# EAGLE design 328 TQFP V3 (EAGLE 6.2)
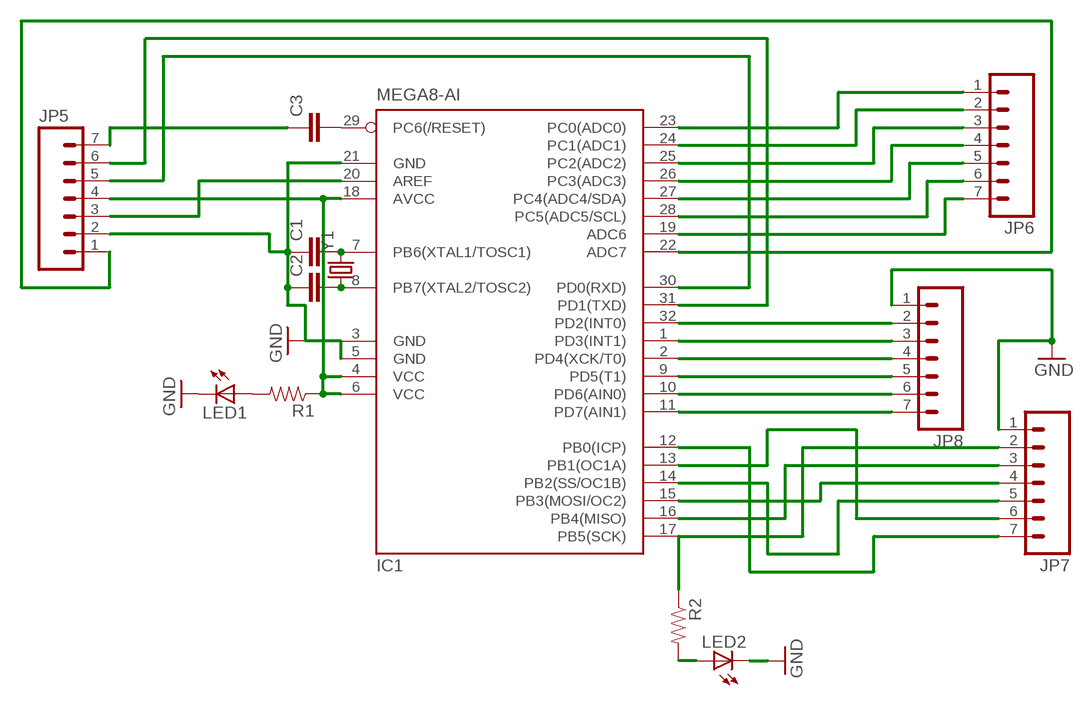
[diagram p0: schematic, sheet 1]

## Parts
C1  CAP0603-CAP  [0603-CAP]
C2  CAP0603-CAP  [0603-CAP]
C3  CAP0603-CAP  [0603-CAP]
IC1  MEGA8-AI  [TQFP32-08]
JP5  M07  [1X07]
JP6  M07  [1X07]
JP7  M07  [1X07]
JP8  M07  [1X07]
LED1  LED0603  [LED-0603]
LED2  LED0603  [LED-0603]
R1  RESISTOR0603-RES  [0603-RES]
R2  RESISTOR0603-RES  [0603-RES]
Y1  CRYSTAL5X3  [CRYSTAL-SMD-5X3]

## Nets
GND: C1.1 C2.1 IC1.3(GND) IC1.5(GND) IC1.21(GND) JP5.2 JP7.1 JP8.1 LED1.C LED2.C
N$1: LED1.A R1.2
N$2: IC1.4(VCC) IC1.6(VCC) IC1.18(AVCC) JP5.4 R1.1
N$3: C1.2 IC1.7(PB6(XTAL1/TOSC1)) Y1.3
N$4: C2.2 IC1.8(PB7(XTAL2/TOSC2)) Y1.1
N$5: C3.1 JP5.7
N$6: IC1.20(AREF) JP5.3
N$7: C3.2 IC1.29(PC6(/RESET))
N$8: IC1.31(PD1(TXD)) JP5.6
N$9: IC1.30(PD0(RXD)) JP5.5
N$10: IC1.23(PC0(ADC0)) JP6.1
N$11: IC1.24(PC1(ADC1)) JP6.2
N$12: IC1.25(PC2(ADC2)) JP6.3
N$13: IC1.26(PC3(ADC3)) JP6.4
N$14: IC1.27(PC4(ADC4/SDA)) JP6.5
N$15: IC1.28(PC5(ADC5/SCL)) JP6.6
N$16: IC1.19(ADC6) JP6.7
N$17: IC1.22(ADC7) JP5.1
N$18: IC1.17(PB5(SCK)) JP7.2 R2.1
N$19: IC1.16(PB4(MISO)) JP7.3
N$20: IC1.15(PB3(MOSI/OC2)) JP7.4
N$21: IC1.14(PB2(SS/OC1B)) JP7.5
N$22: IC1.13(PB1(OC1A)) JP7.6
N$23: IC1.12(PB0(ICP)) JP7.7
N$24: IC1.11(PD7(AIN1)) JP8.7
N$25: IC1.10(PD6(AIN0)) JP8.6
N$26: IC1.9(PD5(T1)) JP8.5
N$27: IC1.2(PD4(XCK/T0)) JP8.4
N$28: IC1.1(PD3(INT1)) JP8.3
N$29: IC1.32(PD2(INT0)) JP8.2
N$30: LED2.A R2.2

## Library data of the parts
C1-C3 = SparkFun:CAP: Capacitor Standard 0603 ceramic capacitor, and 0.1" leaded capacitor.
IC1 = atmel:MEGA8: MICROCONTROLLER 8 Kbytes FLASH, 1 kbytes SRAM, 512 bytes EEPROM, USART, 6-channel 10 bit ADC, 2-channel 8 bit ADC Pin compatible with Atmega48, ATMega88, ATMega168 Source: avr.lbr; MPN: ATMEGA8-16AU; OC_FARNELL: 9171371; OC_NEWARK: 73M8863
JP5-JP8 = SparkFun:M07: Header 7 Standard 7-pin 0.1" header. Use with straight break away headers (SKU : PRT-00116), right angle break away headers (PRT-00553), swiss pins (PRT-00743), machine pins (PRT-00117), and female headers (PRT-00115). NOTES ON THE VARIANTS LOCK and LOCK_LONGPADS... This footprint was designed to help hold the alignment of a through-hole component (i.e. 7-pin header) while soldering it into place. You may notice that each hole has been shifted either up or down by 0.005 of an inch from it's more standard position (which is usually a perfectly straight line). This slight alteration caused the pins (the squares in the middle) to touch the edges of the holes. Because they are alternating, it causes a "brace" to hold the header in place. 0.005 has proven to be the perfect amount of "off-center" position when using our standard breakaway headers. Although looks a little odd when you look at the bare footprint, once you have a header in there, the alteration is very hard to notice. Also, if you push a header all the way into place, it is covered up entirely on the bottom side. This idea of altering the position of holes to aid alignment will be further integrated into the Sparkfun Library for other footprints. It can help hold any component with 3 or more connection pins.
LED1 LED2 = SparkFun:LED: LEDs Standard schematic elements and footprints for 5mm, 3mm, 1206, and 0603 sized LEDs. 5mm - Spark Fun Electronics SKU : COM-00529 (and others)
R1 R2 = SparkFun:RESISTOR: Resistor Basic schematic elements and footprints for 0603, 1206, and PTH resistors.
Y1 = SparkFun:CRYSTAL: Crystals Various standard crystals. Proven footprints. Spark Fun Electronics SKU : COM-00534

## Board
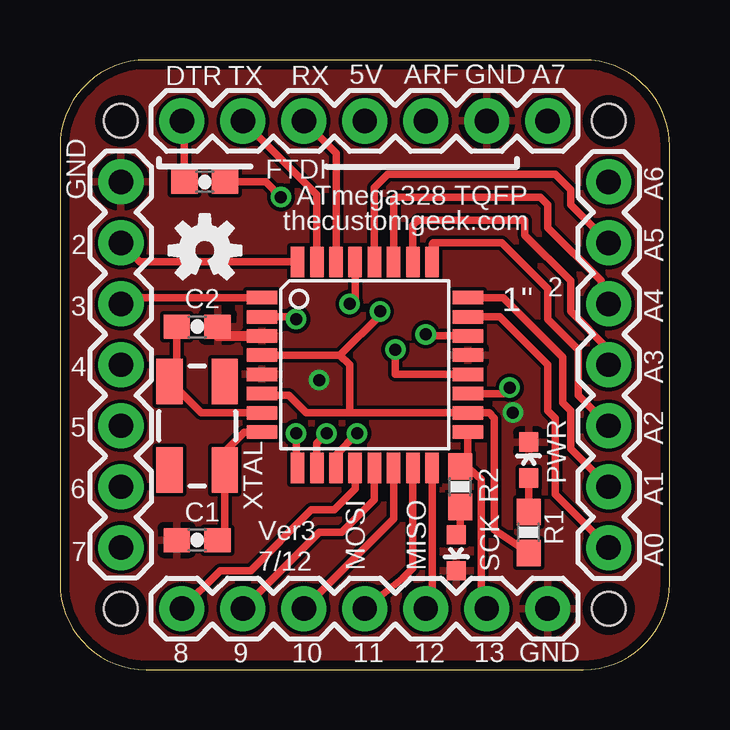
[diagram p1: board, top side]
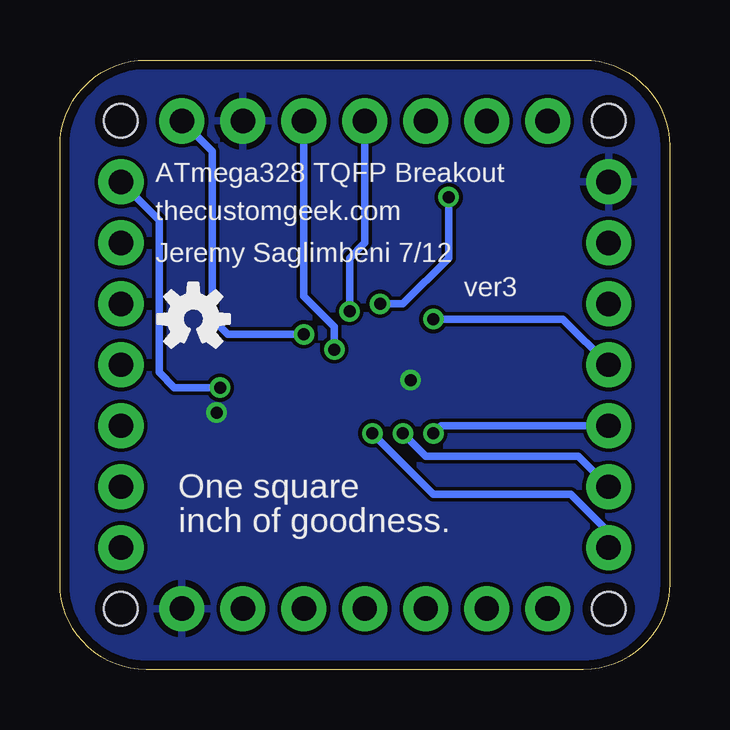
[diagram p2: board, bottom side, seen from below]

Size 25.4 x 25.4 mm. Coordinates in mm from the lower left corner, seen from the top.
Outline: 21.81,0 arc90 25.4,3.59 25.4,21.81 arc90 21.81,25.4 3.59,25.4 arc90 0,21.81 0,3.59 arc90 3.59,0 21.81,0
Copper layers (1*16): Top 0.0356mm / dielectric 1.5011mm / Bottom 0.0356mm
Design rules: minimum track width 6mil, minimum drill 13mil, track to track 6mil, track to pad 6mil, pad to pad 6mil, via to via 6mil, smd to smd 6mil, copper to edge 15mil, drill to drill 6mil, minimum pad ring 7mil, minimum via ring 7mil, stop-mask expansion 4mil, vias tented up to drill 0mil, thermal gap 10mil
Holes 1.4 mm at 2.54,22.86 22.86,22.86 22.86,2.54 2.54,2.54

### Footprints (pad centres in the part's own frame; a part is rotated, then mirrored left to right if it is on the bottom)
0603-CAP = smd 1.1 x 1: 1 -0.85,0; 2 0.85,0
TQFP32-08 = smd 1.27 x 0.559: 1 -4.293,2.8; 2 -4.293,2; 3 -4.293,1.2; 4 -4.293,0.4; 5 -4.293,-0.4; 6 -4.293,-1.2; 7 -4.293,-2; 8 -4.293,-2.8; 17 4.293,-2.8; 18 4.293,-2; 19 4.293,-1.2; 20 4.293,-0.4; 21 4.293,0.4; 22 4.293,1.2; 23 4.293,2; 24 4.293,2.8 | smd 0.559 x 1.27: 9 -2.8,-4.293; 10 -2,-4.293; 11 -1.2,-4.293; 12 -0.4,-4.293; 13 0.4,-4.293; 14 1.2,-4.293; 15 2,-4.293; 16 2.8,-4.293; 25 2.8,4.293; 26 2,4.293; 27 1.2,4.293; 28 0.4,4.293; 29 -0.4,4.293; 30 -1.2,4.293; 31 -2,4.293; 32 -2.8,4.293
1X07 = drill 1.016 pad 1.88: 1 0,0; 2 2.54,0; 3 5.08,0; 4 7.62,0; 5 10.16,0; 6 12.7,0; 7 15.24,0
LED-0603 = smd 0.8 x 0.8: A 0,-0.75; C 0,0.75
0603-RES = smd 1.1 x 1: 1 -0.85,0; 2 0.85,0
CRYSTAL-SMD-5X3 = smd 1.9 x 1.1: 1 -1.85,-1.15; 2 1.85,-1.15; 3 1.85,1.15; 4 -1.85,1.15

### Placement (x,y rotation side)
C1  5.71,14.29 180 top
C2  5.71,5.4 0 top
C3  6.03,20.32 0 top
IC1  12.7,12.7 0 top
JP5  20.32,22.86 180 top
JP6  22.86,5.08 90 top
JP7  20.32,2.54 180 top
JP8  2.54,20.32 270 top
LED1  19.53,8.73 0 top
LED2  16.51,4.87 180 top
R1  19.53,5.71 90 top
R2  16.67,7.62 270 top
U$1  [OSHW-LOGO-S]  6.03,17.46 0 top
U$2  [OSHW-LOGO-S]  19.84,14.61 0 bottom
Y1  5.71,10.16 90 top

### Tracks (layer width: path | path; a pad name or v marks a point on that pad's centre or on a via)
GND  (via drill 0.5)
  Top 0.406: IC1.3 6.57,13.9 C1.1
  other vias: 18.87,10.71 10.79,12.06
  pour Bottom: 0,21.81 arc-90 3.59,25.4 21.81,25.4 arc-90 25.4,21.81 25.4,3.59 arc-90 21.81,0 3.59,0 arc-90 0,3.59
  pour Top: 0,21.81 arc-90 3.59,25.4 21.81,25.4 arc-90 25.4,21.81 25.4,3.59 arc-90 21.81,0 3.59,0 arc-90 0,3.59
N$1
  Top 0.305: R1.2 LED1.A
N$2  (via drill 0.5)
  Top 0.305: 12.06,10.7 10.26,10.7 9.53,11.43 8.48,11.43 IC1.6 | 12.06,10.7 IC1.18 17.88,10.7 18.1,10.48 18.1,5.82 R1.1 | 11.66,13.1 IC1.4 | 11.66,13.1 12.06,12.7 12.06,10.7 | 11.66,13.1 13.34,14.77 v13.34,14.92
  Bottom 0.305: JP5.4 12.7,17.78 13.34,17.14 v13.34,14.92
N$3
  Top 0.305: IC1.7 5.88,10.7 Y1.3 4.87,12.31 C1.2
N$4
  Top 0.305: IC1.8 7.68,9.9 6.99,9.21 6.99,8.43 Y1.1 6.87,5.38 C2.2
N$5
  Top 0.305: C3.1 5.18,22.76 JP5.7
N$6  (via drill 0.5)
  Top 0.305: IC1.20 13.97,12.3 v13.97,13.34
  Bottom 0.305: v13.97,13.34 13.97,14.29 15.24,15.56 JP5.3
N$7  (via drill 0.5)
  Top 0.305: IC1.29 12.3,15.47 v12.06,15.24 | C3.2 8.57,20.32 v9.21,19.68
  Bottom 0.305: v12.06,15.24 11.11,15.24 9.21,17.14 v9.21,19.68
N$8
  Top 0.305: IC1.31 10.7,19.78 JP5.6
N$9
  Top 0.305: IC1.30 11.5,21.52 JP5.5
N$10
  Top 0.305: JP6.1 20.64,7.3 20.64,10.48 20.32,10.79 20.32,12.7 18.32,14.7 IC1.23
N$11
  Top 0.305: JP6.2 21.27,9.21 21.27,10.79 20.95,11.11 20.95,13.02 18.47,15.5 IC1.24
N$12
  Top 0.305: IC1.25 15.5,17.72 15.56,17.78 18.41,17.78 20.32,15.88 20.32,14.61 21.59,13.34 21.59,11.43 JP6.3
N$13
  Top 0.305: IC1.26 14.7,18.51 14.92,18.73 19.37,18.73 19.37,18.1 21.27,16.19 21.27,14.92 22.86,13.34 JP6.4
N$14
  Top 0.305: IC1.27 13.9,19.61 13.97,19.68 20,19.68 20.32,19.37 20.32,18.41 22.54,16.19 22.54,15.56 JP6.5
N$15
  Top 0.305: IC1.28 13.1,20.09 13.65,20.64 20.64,20.64 21.27,20 21.27,19.37 JP6.6
N$16  (via drill 0.5)
  Top 0.305: IC1.19 18.48,11.5 v18.73,11.75
  Bottom 0.305: v18.73,11.75 20.64,11.75 21.27,12.38 21.27,18.73 JP6.7
N$17  (via drill 0.5)
  Top 0.305: IC1.22 15.31,13.9 v15.24,13.97
  Bottom 0.305: v15.24,13.97 18.41,13.97 19.05,14.61 19.05,21.59 JP5.1
N$18
  Top 0.305: IC1.17 16.99,8.79 R2.1 16.93,8.47 17.56,7.94 17.56,2.86 JP7.2
N$19
  Top 0.305: IC1.16 15.5,2.8 JP7.3
N$20
  Top 0.305: IC1.15 14.7,4.22 14.29,3.81 JP7.4
N$21
  Top 0.305: IC1.14 13.9,6.28 JP7.5
N$22
  Top 0.305: IC1.13 13.1,7.07 11.75,5.71 10.79,5.71 JP7.6
N$23
  Top 0.305: IC1.12 12.3,7.54 11.43,6.67 10.48,6.67 7.94,4.13 6.67,4.13 JP7.7
N$24  (via drill 0.5)
  Top 0.305: IC1.11 11.5,8.96 v12.38,9.84
  Bottom 0.305: v12.38,9.84 9.84,7.3 4.13,7.3 2.54,5.71 JP8.7
N$25  (via drill 0.5)
  Top 0.305: IC1.10 10.7,9.43 v11.11,9.84
  Bottom 0.305: v11.11,9.84 10.16,8.89 3.81,8.89 JP8.6
N$26  (via drill 0.5)
  Top 0.305: IC1.9 9.84,8.46 v9.84,9.84
  Bottom 0.305: v9.84,9.84 9.53,10.16 JP8.5
N$27  (via drill 0.5)
  Top 0.305: IC1.2 9.75,14.7 v9.84,14.61
  Bottom 0.305: v9.84,14.61 4.45,14.61 JP8.4
N$28
  Top 0.305: IC1.1 2.8,15.5 JP8.3
N$29
  Top 0.305: IC1.32 3.33,16.99 JP8.2
N$30
  Top 0.305: R2.2 16.67,5.78 LED2.A

### Text on the board
tPlace: DTR | TX | RX | 5V | ARF | GND | A7 | FTDI | A6 | GND | ATmega328 TQFP | 2 | thecustomgeek.com | A5 | 3 | C2 | 2 | A4 | 1" | 4 | A3 | 5 | A2 | XTAL | 6 | PWR | A1 | C1 | R2 | A0 | 7 | Ver3 | R1 | 7/12 | MOSI | MISO | SCK | 8 | 9 | 10 | 11 | 12 | 13 | GND
bPlace: ATmega328 TQFP Breakout | thecustomgeek.com | Jeremy Saglimbeni 7/12 | ver3 | One square | inch of goodness.